# EAGLE design carrier_v2 (EAGLE 5.12)
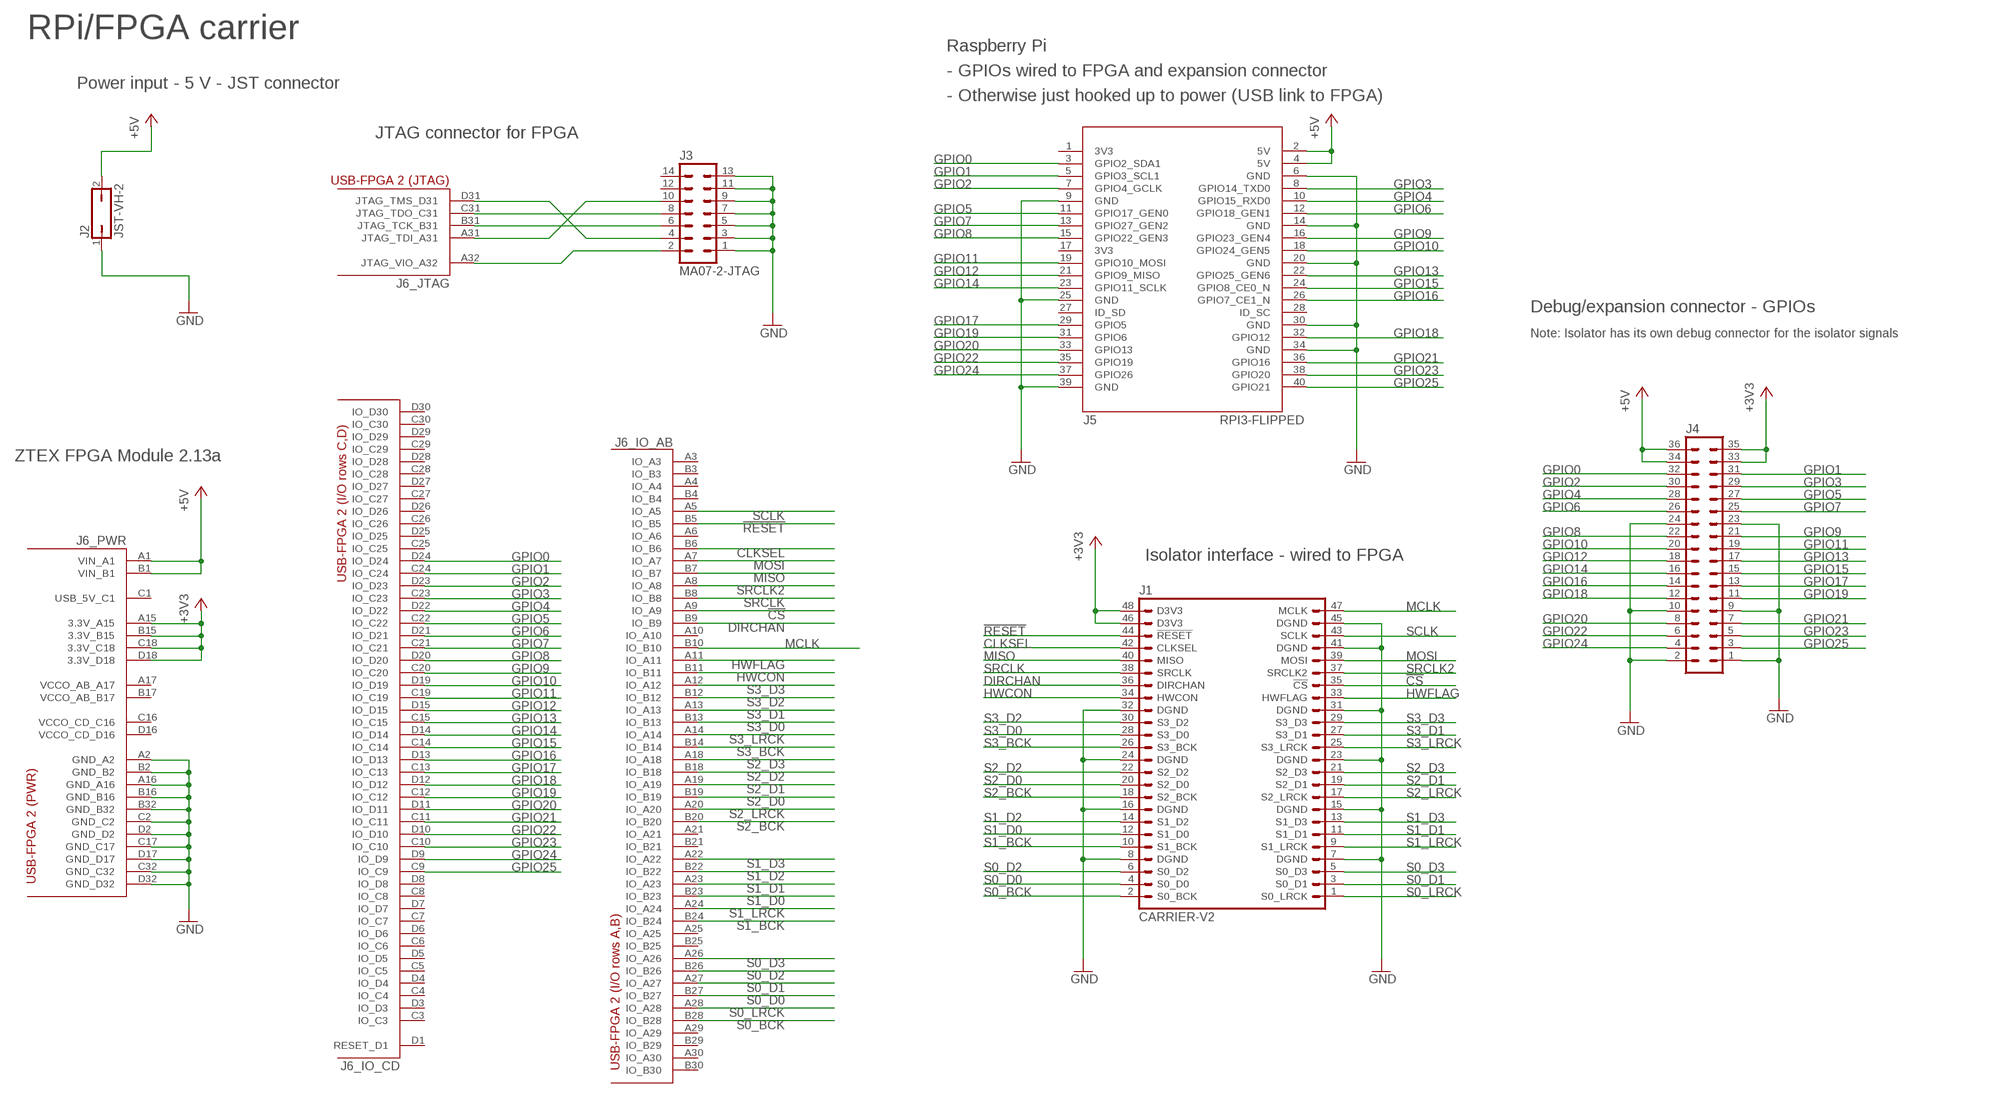
[diagram p0: schematic, sheet 1]

## Parts
J1  CARRIER-V2  [MA24-2]
J2  JST-VH-2  [JST-VH-2]
J3  MA07-2-JTAG  [MA07-2-JTAG]
J4  MA18-2  [MA18-2]
J5  RPI3-FLIPPED  [RPI3-FLIPPED]
J6  USB-FPGA-2THT  [USB-FPGA-2-THT]

## Nets
!CS: J1.35(!CS) J6.A9(_IO_AB:IO_A9)
!RESET: J1.44(!RESET) J6.B5(_IO_AB:IO_B5)
+3V3: J1.46(D3V3) J1.48(D3V3) J4.33 J4.35 J6.A15(_PWR:3.3V_A15) J6.B15(_PWR:3.3V_B15) J6.C18(_PWR:3.3V_C18) J6.D18(_PWR:3.3V_D18)
+5V: J2.2 J4.34 J4.36 J5.2(5V) J5.4(5V) J6.A1(_PWR:VIN_A1) J6.B1(_PWR:VIN_B1)
CLKSEL: J1.42(CLKSEL) J6.B6(_IO_AB:IO_B6)
DIRCHAN: J1.36(DIRCHAN) J6.B9(_IO_AB:IO_B9)
GND: J1.7(DGND) J1.8(DGND) J1.15(DGND) J1.16(DGND) J1.23(DGND) J1.24(DGND) J1.31(DGND) J1.32(DGND) J1.41(DGND) J1.45(DGND) J2.1 J3.1 J3.3 J3.5 J3.7 J3.9 J3.11 J3.13 J4.1 J4.2 J4.9 J4.10 J4.23 J4.24 J5.6(GND) J5.9(GND) J5.14(GND) J5.20(GND) J5.25(GND) J5.30(GND) J5.34(GND) J5.39(GND) J6.A2(_PWR:GND_A2) J6.A16(_PWR:GND_A16) J6.B2(_PWR:GND_B2) J6.B16(_PWR:GND_B16) J6.B32(_PWR:GND_B32) J6.C2(_PWR:GND_C2) J6.C17(_PWR:GND_C17) J6.C32(_PWR:GND_C32) J6.D2(_PWR:GND_D2) J6.D17(_PWR:GND_D17) J6.D32(_PWR:GND_D32)
GPIO0: J4.32 J5.3(GPIO2_SDA1) J6.D24(_IO_CD:IO_D24)
GPIO1: J4.31 J5.5(GPIO3_SCL1) J6.C24(_IO_CD:IO_C24)
GPIO2: J4.30 J5.7(GPIO4_GCLK) J6.D23(_IO_CD:IO_D23)
GPIO3: J4.29 J5.8(GPIO14_TXD0) J6.C23(_IO_CD:IO_C23)
GPIO4: J4.28 J5.10(GPIO15_RXD0) J6.D22(_IO_CD:IO_D22)
GPIO5: J4.27 J5.11(GPIO17_GEN0) J6.C22(_IO_CD:IO_C22)
GPIO6: J4.26 J5.12(GPIO18_GEN1) J6.D21(_IO_CD:IO_D21)
GPIO7: J4.25 J5.13(GPIO27_GEN2) J6.C21(_IO_CD:IO_C21)
GPIO8: J4.22 J5.15(GPIO22_GEN3) J6.D20(_IO_CD:IO_D20)
GPIO9: J4.21 J5.16(GPIO23_GEN4) J6.C20(_IO_CD:IO_C20)
GPIO10: J4.20 J5.18(GPIO24_GEN5) J6.D19(_IO_CD:IO_D19)
GPIO11: J4.19 J5.19(GPIO10_MOSI) J6.C19(_IO_CD:IO_C19)
GPIO12: J4.18 J5.21(GPIO9_MISO) J6.D15(_IO_CD:IO_D15)
GPIO13: J4.17 J5.22(GPIO25_GEN6) J6.C15(_IO_CD:IO_C15)
GPIO14: J4.16 J5.23(GPIO11_SCLK) J6.D14(_IO_CD:IO_D14)
GPIO15: J4.15 J5.24(GPIO8_CE0_N) J6.C14(_IO_CD:IO_C14)
GPIO16: J4.14 J5.26(GPIO7_CE1_N) J6.D13(_IO_CD:IO_D13)
GPIO17: J4.13 J5.29(GPIO5) J6.C13(_IO_CD:IO_C13)
GPIO18: J4.12 J5.32(GPIO12) J6.D12(_IO_CD:IO_D12)
GPIO19: J4.11 J5.31(GPIO6) J6.C12(_IO_CD:IO_C12)
GPIO20: J4.8 J5.33(GPIO13) J6.D11(_IO_CD:IO_D11)
GPIO21: J4.7 J5.36(GPIO16) J6.C11(_IO_CD:IO_C11)
GPIO22: J4.6 J5.35(GPIO19) J6.D10(_IO_CD:IO_D10)
GPIO23: J4.5 J5.38(GPIO20) J6.C10(_IO_CD:IO_C10)
GPIO24: J4.4 J5.37(GPIO26) J6.D9(_IO_CD:IO_D9)
GPIO25: J4.3 J5.40(GPIO21) J6.C9(_IO_CD:IO_C9)
HWCON: J1.34(HWCON) J6.B11(_IO_AB:IO_B11)
HWFLAG: J1.33(HWFLAG) J6.A11(_IO_AB:IO_A11)
MCLK: J1.47(MCLK) J6.B10(_IO_AB:IO_B10)
MISO: J1.40(MISO) J6.B7(_IO_AB:IO_B7)
MOSI: J1.39(MOSI) J6.A7(_IO_AB:IO_A7)
N$1: J3.2 J6.A32(_JTAG:JTAG_VIO_A32)
N$2: J3.4 J6.D31(_JTAG:JTAG_TMS_D31)
N$3: J3.6 J6.B31(_JTAG:JTAG_TCK_B31)
N$4: J3.8 J6.C31(_JTAG:JTAG_TDO_C31)
N$5: J3.10 J6.A31(_JTAG:JTAG_TDI_A31)
S0_BCK: J1.2(S0_BCK) J6.B28(_IO_AB:IO_B28)
S0_D0: J1.4(S0_D0) J6.B27(_IO_AB:IO_B27)
S0_D1: J1.3(S0_D1) J6.A27(_IO_AB:IO_A27)
S0_D2: J1.6(S0_D2) J6.B26(_IO_AB:IO_B26)
S0_D3: J1.5(S0_D3) J6.A26(_IO_AB:IO_A26)
S0_LRCK: J1.1(S0_LRCK) J6.A28(_IO_AB:IO_A28)
S1_BCK: J1.10(S1_BCK) J6.B24(_IO_AB:IO_B24)
S1_D0: J1.12(S1_D0) J6.B23(_IO_AB:IO_B23)
S1_D1: J1.11(S1_D1) J6.A23(_IO_AB:IO_A23)
S1_D2: J1.14(S1_D2) J6.B22(_IO_AB:IO_B22)
S1_D3: J1.13(S1_D3) J6.A22(_IO_AB:IO_A22)
S1_LRCK: J1.9(S1_LRCK) J6.A24(_IO_AB:IO_A24)
S2_BCK: J1.18(S2_BCK) J6.B20(_IO_AB:IO_B20)
S2_D0: J1.20(S2_D0) J6.B19(_IO_AB:IO_B19)
S2_D1: J1.19(S2_D1) J6.A19(_IO_AB:IO_A19)
S2_D2: J1.22(S2_D2) J6.B18(_IO_AB:IO_B18)
S2_D3: J1.21(S2_D3) J6.A18(_IO_AB:IO_A18)
S2_LRCK: J1.17(S2_LRCK) J6.A20(_IO_AB:IO_A20)
S3_BCK: J1.26(S3_BCK) J6.B14(_IO_AB:IO_B14)
S3_D0: J1.28(S3_D0) J6.B13(_IO_AB:IO_B13)
S3_D1: J1.27(S3_D1) J6.A13(_IO_AB:IO_A13)
S3_D2: J1.30(S3_D2) J6.B12(_IO_AB:IO_B12)
S3_D3: J1.29(S3_D3) J6.A12(_IO_AB:IO_A12)
S3_LRCK: J1.25(S3_LRCK) J6.A14(_IO_AB:IO_A14)
SCLK: J1.43(SCLK) J6.A5(_IO_AB:IO_A5)
SRCLK: J1.38(SRCLK) J6.B8(_IO_AB:IO_B8)
SRCLK2: J1.37(SRCLK2) J6.A8(_IO_AB:IO_A8)
Unconnected: J3.12 J3.14 J5.1(3V3) J5.17(3V3) J5.27(ID_SD) J5.28(ID_SC) J6.A3(_IO_AB:IO_A3) J6.A4(_IO_AB:IO_A4) J6.A6(_IO_AB:IO_A6) J6.A10(_IO_AB:IO_A10) J6.A17(_PWR:VCCO_AB_A17) J6.A21(_IO_AB:IO_A21) J6.A25(_IO_AB:IO_A25) J6.A29(_IO_AB:IO_A29) J6.A30(_IO_AB:IO_A30) J6.B3(_IO_AB:IO_B3) J6.B4(_IO_AB:IO_B4) J6.B17(_PWR:VCCO_AB_B17) J6.B21(_IO_AB:IO_B21) J6.B25(_IO_AB:IO_B25) J6.B29(_IO_AB:IO_B29) J6.B30(_IO_AB:IO_B30) J6.C1(_PWR:USB_5V_C1) J6.C3(_IO_CD:IO_C3) J6.C4(_IO_CD:IO_C4) J6.C5(_IO_CD:IO_C5) J6.C6(_IO_CD:IO_C6) J6.C7(_IO_CD:IO_C7) J6.C8(_IO_CD:IO_C8) J6.C16(_PWR:VCCO_CD_C16) J6.C25(_IO_CD:IO_C25) J6.C26(_IO_CD:IO_C26) J6.C27(_IO_CD:IO_C27) J6.C28(_IO_CD:IO_C28) J6.C29(_IO_CD:IO_C29) J6.C30(_IO_CD:IO_C30) J6.D1(_IO_CD:RESET_D1) J6.D3(_IO_CD:IO_D3) J6.D4(_IO_CD:IO_D4) J6.D5(_IO_CD:IO_D5) J6.D6(_IO_CD:IO_D6) J6.D7(_IO_CD:IO_D7) J6.D8(_IO_CD:IO_D8) J6.D16(_PWR:VCCO_CD_D16) J6.D25(_IO_CD:IO_D25) J6.D26(_IO_CD:IO_D26) J6.D27(_IO_CD:IO_D27) J6.D28(_IO_CD:IO_D28) J6.D29(_IO_CD:IO_D29) J6.D30(_IO_CD:IO_D30)

## Notes on the sheet
- RPi/FPGA carrier
- Raspberry Pi
- - GPIOs wired to FPGA and expansion connector
- Power input - 5 V - JST connector
- - Otherwise just hooked up to power (USB link to FPGA)
- JTAG connector for FPGA
- Debug/expansion connector - GPIOs
- Note: Isolator has its own debug connector for the isolator signals
- ZTEX FPGA Module 2.13a
- Isolator interface - wired to FPGA

## Library data of the parts
J1 = cdp:CARRIER-V2
J2 = cdp:JST-VH-2
J3 = cdp:MA07-2-JTAG
J4 = con-lstb:MA18-2: PIN HEADER; OC_FARNELL: unknown; OC_NEWARK: unknown
J5 = cdp:RPI3-FLIPPED
J6 = ztex-usb-fpga-2:USB-FPGA-2

## Board
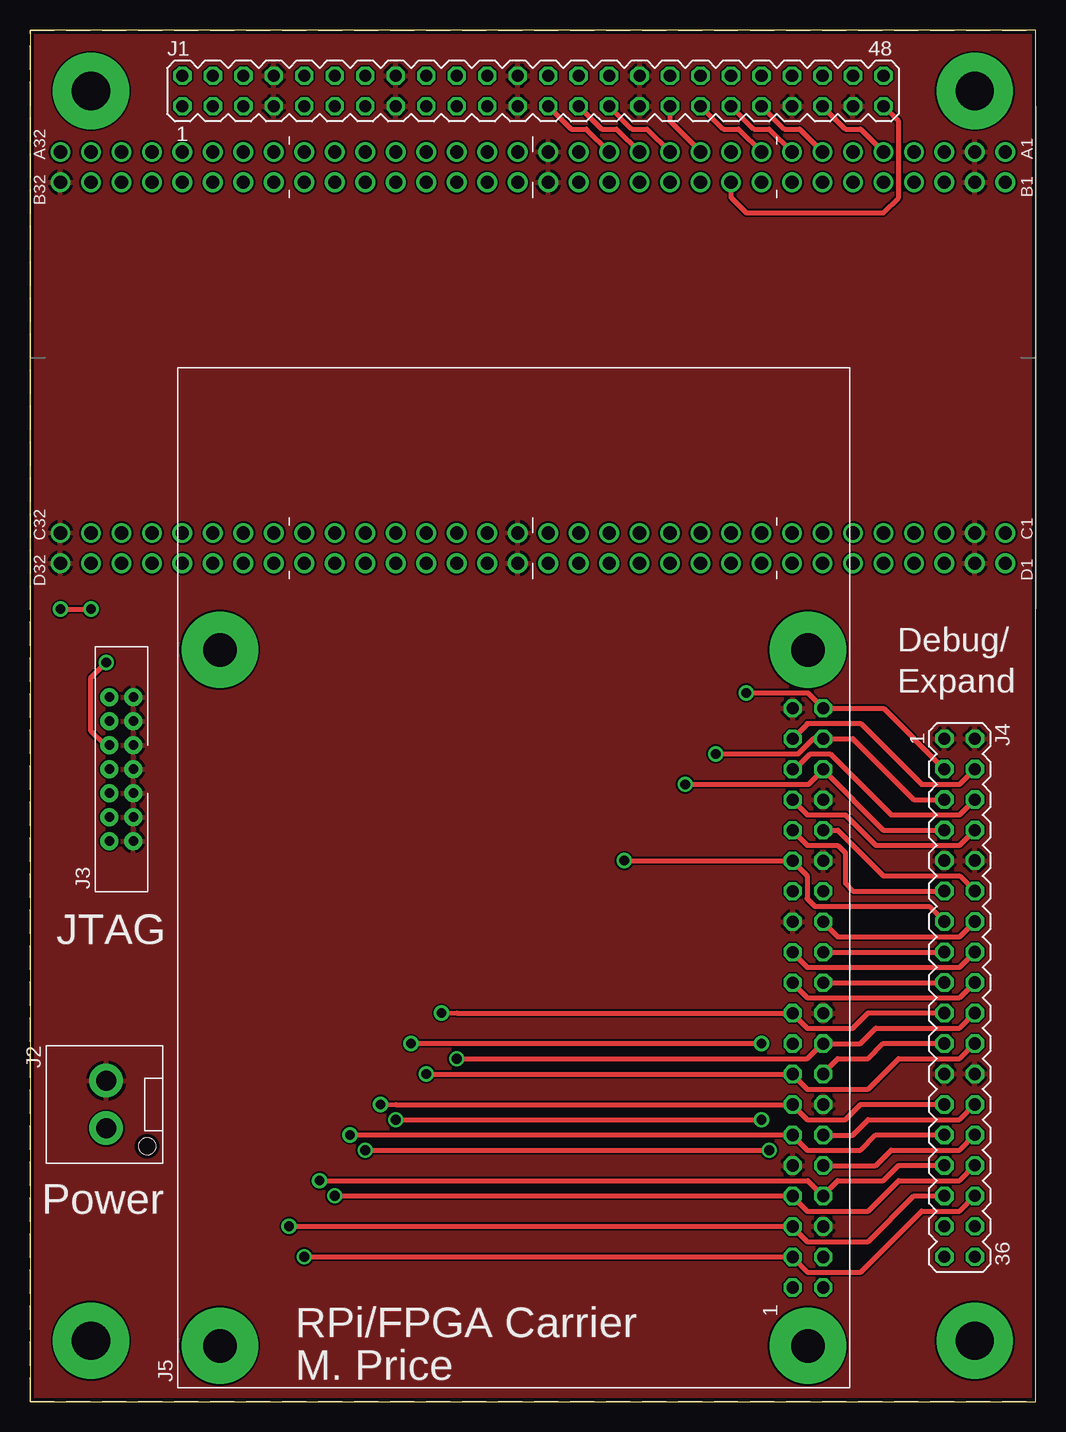
[diagram p1: board, top side]
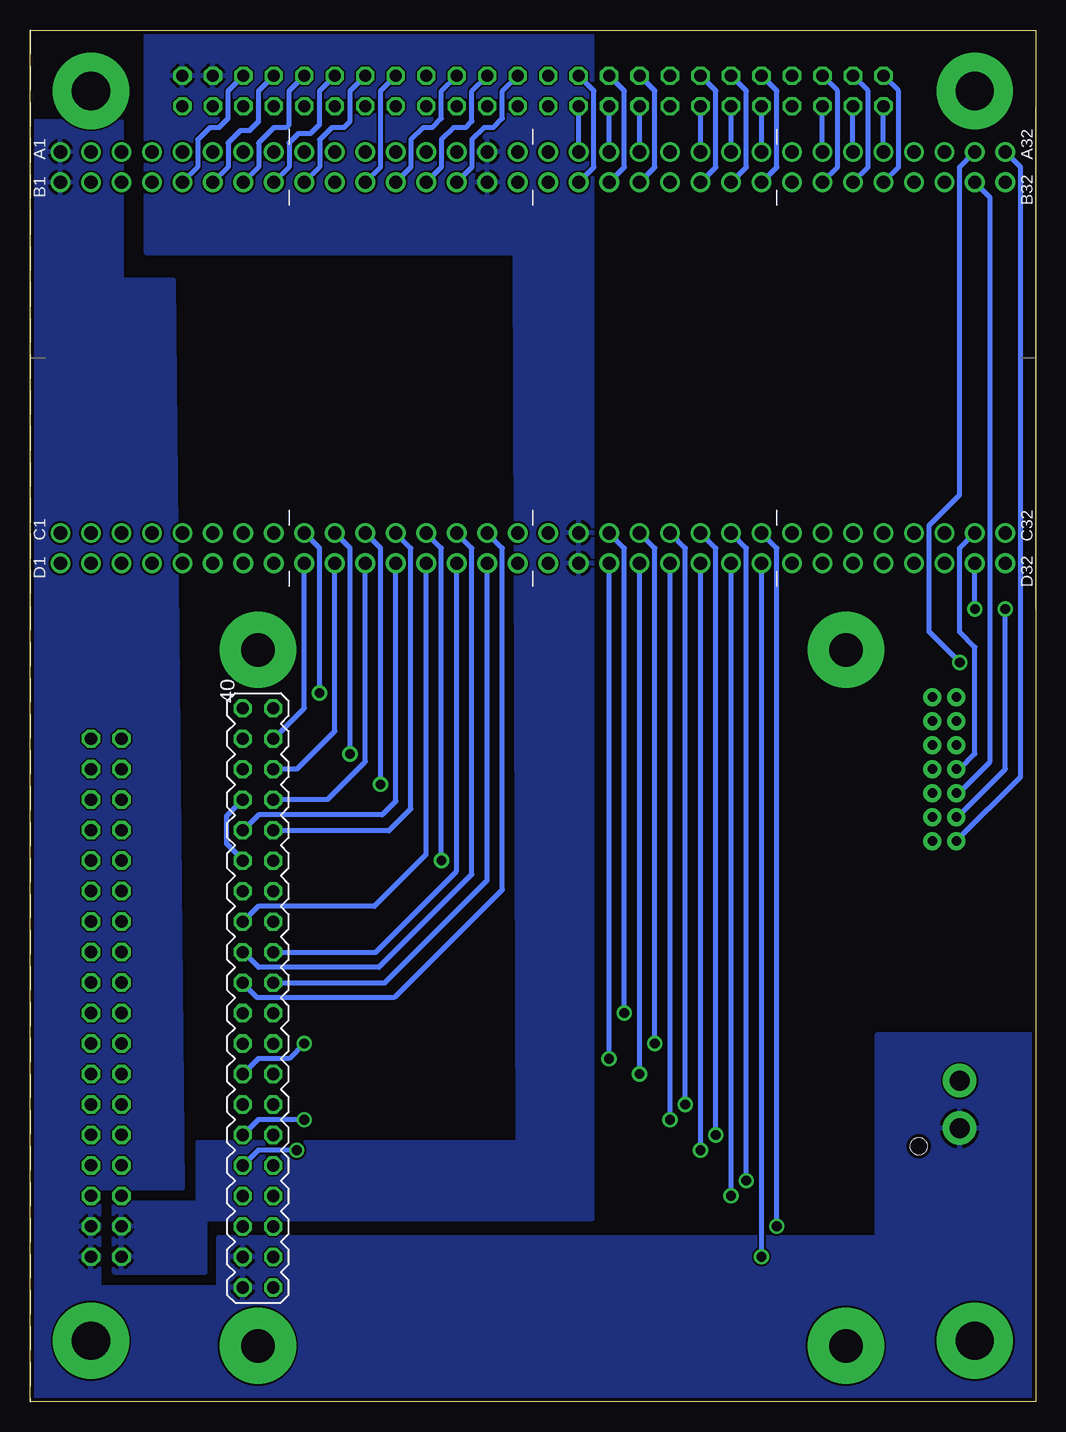
[diagram p2: board, bottom side, seen from below]

Size 83.82 x 114.3 mm. Coordinates in mm from the lower left corner, seen from the top.
Outline: 0,0 83.82,0 83.82,114.3 0,114.3 0,0
Copper layers (1*16): Top 0.035mm / dielectric 1.6mm / Bottom 0.035mm
Design rules "Elecrow_2-layer_PCB_eagle_rule_mod": minimum track width 6mil, minimum drill 12mil, track to track 6mil, track to pad 6mil, pad to pad 6mil, via to via 8mil, smd to smd 0mil, copper to edge 12mil, drill to drill 10mil, minimum pad ring 6mil, minimum via ring 6mil, stop-mask expansion 0mil, vias tented up to drill 100mil, thermal gap 10mil

### Footprints (pad centres in the part's own frame; a part is rotated, then mirrored left to right if it is on the bottom)
MA24-2 = drill 1.016 octagon: 1 -29.21,-1.27; 2 -29.21,1.27; 3 -26.67,-1.27; 4 -26.67,1.27; 5 -24.13,-1.27; 6 -24.13,1.27; 7 -21.59,-1.27; 8 -21.59,1.27; 9 -19.05,-1.27; 10 -19.05,1.27; 11 -16.51,-1.27; 12 -16.51,1.27; 13 -13.97,-1.27; 14 -13.97,1.27; 15 -11.43,-1.27; 16 -11.43,1.27; 17 -8.89,-1.27; 18 -8.89,1.27; 19 -6.35,-1.27; 20 -6.35,1.27; 21 -3.81,-1.27; 22 -3.81,1.27; 23 -1.27,-1.27; 24 -1.27,1.27; 25 1.27,-1.27; 26 1.27,1.27; 27 3.81,-1.27; 28 3.81,1.27; 29 6.35,-1.27; 30 6.35,1.27; 31 8.89,-1.27; 32 8.89,1.27; 33 11.43,-1.27; 34 11.43,1.27; 35 13.97,-1.27; 36 13.97,1.27; 37 16.51,-1.27; 38 16.51,1.27; 39 19.05,-1.27; 40 19.05,1.27; 41 21.59,-1.27; 42 21.59,1.27; 43 24.13,-1.27; 44 24.13,1.27; 45 26.67,-1.27; 46 26.67,1.27; 47 29.21,-1.27; 48 29.21,1.27 | drill 3.175 pad 6.35 round: DP1 -36.83,0; DP2 36.83,0; DP3 -36.83,-104.14; DP4 36.83,-104.14
JST-VH-2 = drill 1.65 pad 2.8 round: 1 -1.98,0; 2 1.98,0 | hole 1.4: 3.48,3.4
MA07-2-JTAG = drill 0.8 pad 1.5 round: 1 -6,-1; 2 -6,1; 3 -4,-1; 4 -4,1; 5 -2,-1; 6 -2,1; 7 0,-1; 8 0,1; 9 2,-1; 10 2,1; 11 4,-1; 12 4,1; 13 6,-1; 14 6,1
MA18-2 = drill 1.016 octagon: 1 -21.59,-1.27; 2 -21.59,1.27; 3 -19.05,-1.27; 4 -19.05,1.27; 5 -16.51,-1.27; 6 -16.51,1.27; 7 -13.97,-1.27; 8 -13.97,1.27; 9 -11.43,-1.27; 10 -11.43,1.27; 11 -8.89,-1.27; 12 -8.89,1.27; 13 -6.35,-1.27; 14 -6.35,1.27; 15 -3.81,-1.27; 16 -3.81,1.27; 17 -1.27,-1.27; 18 -1.27,1.27; 19 1.27,-1.27; 20 1.27,1.27; 21 3.81,-1.27; 22 3.81,1.27; 23 6.35,-1.27; 24 6.35,1.27; 25 8.89,-1.27; 26 8.89,1.27; 27 11.43,-1.27; 28 11.43,1.27; 29 13.97,-1.27; 30 13.97,1.27; 31 16.51,-1.27; 32 16.51,1.27; 33 19.05,-1.27; 34 19.05,1.27; 35 21.59,-1.27; 36 21.59,1.27
RPI3-FLIPPED = drill 1.016 octagon: 1 8.37,4.77; 2 8.37,2.23; 3 10.91,4.77; 4 10.91,2.23; 5 13.45,4.77; 6 13.45,2.23; 7 15.99,4.77; 8 15.99,2.23; 9 18.53,4.77; 10 18.53,2.23; 11 21.07,4.77; 12 21.07,2.23; 13 23.61,4.77; 14 23.61,2.23; 15 26.15,4.77; 16 26.15,2.23; 17 28.69,4.77; 18 28.69,2.23; 19 31.23,4.77; 20 31.23,2.23; 21 33.77,4.77; 22 33.77,2.23; 23 36.31,4.77; 24 36.31,2.23; 25 38.85,4.77; 26 38.85,2.23; 27 41.39,4.77; 28 41.39,2.23; 29 43.93,4.77; 30 43.93,2.23; 31 46.47,4.77; 32 46.47,2.23; 33 49.01,4.77; 34 49.01,2.23; 35 51.55,4.77; 36 51.55,2.23; 37 54.09,4.77; 38 54.09,2.23; 39 56.63,4.77; 40 56.63,2.23 | drill 2.794 pad 6.35 round: P$1 3.5,3.5; P$2 61.5,3.5; P$3 3.5,52.5; P$4 61.5,52.5
USB-FPGA-2-THT = drill 1.1 round: A1 2.54,2.54; A2 5.08,2.54; A3 7.62,2.54; A4 10.16,2.54; A5 12.7,2.54; A6 15.24,2.54; A7 17.78,2.54; A8 20.32,2.54; A9 22.86,2.54; A10 25.4,2.54; A11 27.94,2.54; A12 30.48,2.54; A13 33.02,2.54; A14 35.56,2.54; A15 38.1,2.54; A16 40.64,2.54; A17 43.18,2.54; A18 45.72,2.54; A19 48.26,2.54; A20 50.8,2.54; A21 53.34,2.54; A22 55.88,2.54; A23 58.42,2.54; A24 60.96,2.54; A25 63.5,2.54; A26 66.04,2.54; A27 68.58,2.54; A28 71.12,2.54; A29 73.66,2.54; A30 76.2,2.54; A31 78.74,2.54; A32 81.28,2.54; B1 2.54,5.08; B2 5.08,5.08; B3 7.62,5.08; B4 10.16,5.08; B5 12.7,5.08; B6 15.24,5.08; B7 17.78,5.08; B8 20.32,5.08; B9 22.86,5.08; B10 25.4,5.08; B11 27.94,5.08; B12 30.48,5.08; B13 33.02,5.08; B14 35.56,5.08; B15 38.1,5.08; B16 40.64,5.08; B17 43.18,5.08; B18 45.72,5.08; B19 48.26,5.08; B20 50.8,5.08; B21 53.34,5.08; B22 55.88,5.08; B23 58.42,5.08; B24 60.96,5.08; B25 63.5,5.08; B26 66.04,5.08; B27 68.58,5.08; B28 71.12,5.08; B29 73.66,5.08; B30 76.2,5.08; B31 78.74,5.08; B32 81.28,5.08; C1 2.54,34.29; C2 5.08,34.29; C3 7.62,34.29; C4 10.16,34.29; C5 12.7,34.29; C6 15.24,34.29; C7 17.78,34.29; C8 20.32,34.29; C9 22.86,34.29; C10 25.4,34.29; C11 27.94,34.29; C12 30.48,34.29; C13 33.02,34.29; C14 35.56,34.29; C15 38.1,34.29; C16 40.64,34.29; C17 43.18,34.29; C18 45.72,34.29; C19 48.26,34.29; C20 50.8,34.29; C21 53.34,34.29; C22 55.88,34.29; C23 58.42,34.29; C24 60.96,34.29; C25 63.5,34.29; C26 66.04,34.29; C27 68.58,34.29; C28 71.12,34.29; C29 73.66,34.29; C30 76.2,34.29; C31 78.74,34.29; C32 81.28,34.29; D1 2.54,36.83; D2 5.08,36.83; D3 7.62,36.83; D4 10.16,36.83; D5 12.7,36.83; D6 15.24,36.83; D7 17.78,36.83; D8 20.32,36.83; D9 22.86,36.83; D10 25.4,36.83; D11 27.94,36.83; D12 30.48,36.83; D13 33.02,36.83; D14 35.56,36.83; D15 38.1,36.83; D16 40.64,36.83; D17 43.18,36.83; D18 45.72,36.83; D19 48.26,36.83; D20 50.8,36.83; D21 53.34,36.83; D22 55.88,36.83; D23 58.42,36.83; D24 60.96,36.83; D25 63.5,36.83; D26 66.04,36.83; D27 68.58,36.83; D28 71.12,36.83; D29 73.66,36.83; D30 76.2,36.83; D31 78.74,36.83; D32 81.28,36.83

### Placement (x,y rotation side)
J1  41.91,109.22 0 top
J2  6.35,24.77 270 top
J3  7.62,52.7 90 top
J4  77.47,33.66 270 top
J5  68.33,1.14 90 top
J6  83.82,106.68 180 top

### Tracks (layer width: path | path; a pad name or v marks a point on that pad's centre or on a via)
!CS
  Top 0.406: J6.A9 59.05,106.05 57.78,106.05 J1.35
!RESET
  Bottom 0.406: J6.B5 69.85,102.87 69.85,105.16 68.83,106.17 68.07,106.17 67.31,106.93 67.31,109.22 J1.44
+3V3
  pour Bottom: 74.17,114.3 74.17,95.76 43.43,95.76 43.18,21.59 69.85,21.59 69.85,16.51 76.83,16.51 76.83,10.79 69.22,10.79 69.22,15.24 43.43,15.24 36.96,15.24 36.96,114.3
+5V
  pour Bottom: 83.57,93.47 83.82,106.68 76.2,106.68 76.2,93.47 71.88,93.47 71.12,17.78 78.11,17.78 78.11,9.53 68.07,9.53 68.07,13.72 13.21,13.72 13.21,30.61 0.25,30.61 0.25,0 83.57,0
CLKSEL
  Bottom 0.406: J6.B6 67.31,102.87 67.31,104.9 66.29,105.92 65.53,105.92 64.77,106.68 64.77,109.22 J1.42
DIRCHAN
  Bottom 0.406: J6.B9 59.69,102.87 59.69,105.16 58.67,106.17 57.66,106.17 57.15,106.68 57.15,109.22 J1.36
GND
  Bottom 0.406: J5.30 66.1,45.14 67.44,46.48 67.44,48.81 J5.34
  pour Top: 0,114.3 84.07,114.3 84.07,0 0,0
GPIO0  (via drill 0.81 pad 1.27)
  Top 0.406: J4.32 77.47,15.88 74.3,15.88 69.22,10.79 64.77,10.79 63.56,12.01 J5.3 63.54,12.06 v22.86,12.06
  Bottom 0.406: v22.86,12.06 J6.D24
GPIO1  (via drill 0.81 pad 1.27)
  Top 0.406: J4.31 73.66,17.14 69.85,13.34 64.77,13.34 63.56,14.55 J5.5 63.54,14.61 v21.59,14.61
  Bottom 0.406: J6.C24 21.59,71.12 v21.59,14.61
GPIO2  (via drill 0.81 pad 1.27)
  Top 0.406: J4.30 77.47,18.41 72.39,18.41 69.85,15.88 64.77,15.88 63.56,17.09 J5.7 63.54,17.14 v25.4,17.14
  Bottom 0.406: v25.4,17.14 J6.D23
GPIO3  (via drill 0.81 pad 1.27)
  Top 0.406: J4.29 72.39,19.68 71.12,18.41 67.31,18.41 66.1,17.2 J5.8 64.81,18.41 v24.13,18.41
  Bottom 0.406: J6.C23 24.13,71.12 v24.13,18.41
GPIO4  (via drill 0.81 pad 1.27)
  Top 0.406: J4.28 77.47,20.95 71.75,20.95 70.47,19.67 J5.10 | v27.94,20.95 v61.59,20.95
  Bottom 0.406: v27.94,20.95 J6.D22 | v61.59,20.95 64.81,20.95 J5.10
GPIO5  (via drill 0.81 pad 1.27)
  Top 0.406: J4.27 70.48,22.23 69.22,20.95 64.77,20.95 63.56,22.17 J5.11 63.54,22.23 v26.67,22.23
  Bottom 0.406: J6.C22 26.67,71.12 v26.67,22.23
GPIO6  (via drill 0.81 pad 1.27)
  Top 0.406: J4.26 77.47,23.5 69.85,23.5 68.57,22.21 J5.12 | v30.48,23.5 v60.96,23.5
  Bottom 0.406: v30.48,23.5 J6.D21 | v60.96,23.5 64.81,23.5 J5.12
GPIO7  (via drill 0.81 pad 1.27)
  Top 0.406: J4.25 69.22,24.77 67.94,23.5 64.77,23.5 63.56,24.71 J5.13 30.49,24.75 v29.21,24.77
  Bottom 0.406: v29.21,24.77 29.21,71.12 J6.C21
GPIO8  (via drill 0.81 pad 1.27)
  Top 0.406: J4.22 77.47,28.57 72.39,28.57 69.85,26.04 64.77,26.04 63.56,27.25 J5.15 33.03,27.29 v33.02,27.3
  Bottom 0.406: v33.02,27.3 J6.D20
GPIO9  (via drill 0.81 pad 1.27)
  Top 0.406: J4.21 71.12,29.84 69.85,28.57 67.31,28.57 66.1,27.36 J5.16 | v31.75,29.84 v60.96,29.84
  Bottom 0.406: J6.C20 31.75,71.12 v31.75,29.84 | v60.96,29.84 62.23,28.57 64.81,28.57 J5.16
GPIO10  (via drill 0.81 pad 1.27)
  Top 0.406: J4.20 77.47,31.11 70.48,31.11 69.2,29.83 J5.18 66.03,29.83 64.77,28.57 v35.56,28.57
  Bottom 0.406: v35.56,28.57 J6.D19
GPIO11  (via drill 0.81 pad 1.27)
  Top 0.406: J4.19 69.85,32.38 68.58,31.11 64.77,31.11 63.56,32.33 J5.19 35.57,32.37 v34.29,32.38
  Bottom 0.406: v34.29,32.38 34.29,71.12 J6.C19
GPIO12
  Top 0.406: J4.18 77.47,33.66 64.77,33.66 63.56,34.87 J5.21
  Bottom 0.406: J6.D15 45.72,43.43 54.28,34.87 63.51,34.87 J5.21
GPIO13
  Top 0.406: J4.17 76.19,34.91 J5.22
  Bottom 0.406: J6.C15 44.45,71.12 44.45,42.67 53.47,33.66 64.9,33.66 66.1,34.85 J5.22
GPIO14
  Top 0.406: J4.16 77.47,36.2 64.77,36.2 63.56,37.41 J5.23
  Bottom 0.406: J6.D14 48.26,44.2 55.05,37.41 63.51,37.41 J5.23
GPIO15
  Top 0.406: J4.15 76.19,37.45 J5.24
  Bottom 0.406: J6.C14 46.99,71.12 46.99,43.94 54.74,36.2 64.77,36.2 66.03,37.45 J5.24
GPIO16
  Top 0.406: J4.14 77.47,38.73 67.31,38.73 66.1,39.95 J5.26
  Bottom 0.406: J6.D13 50.8,45.59 55.12,41.27 64.81,41.27 J5.26
GPIO17  (via drill 0.81 pad 1.27)
  Top 0.406: J4.13 74.93,41.27 65.41,41.27 64.77,41.91 64.77,43.81 63.56,45.03 J5.29 49.54,45.07 v49.53,45.09
  Bottom 0.406: J6.C13 49.53,71.12 49.53,45.59 v49.53,45.09
GPIO18
  Top 0.406: J4.12 77.47,43.81 71.12,43.81 67.32,47.61 J5.32
  Bottom 0.406: J6.D12 53.34,50.04 54.48,48.9 64.77,48.9 66.05,47.61 J5.32
GPIO19
  Top 0.406: J4.11 68.58,42.55 67.94,43.18 67.94,45.72 67.31,46.35 64.77,46.35 63.56,47.57 J5.31
  Bottom 0.406: J6.C12 52.07,71.12 52.07,49.4 53.9,47.57 63.51,47.57 J5.31
GPIO20
  Top 0.406: J4.8 77.47,46.35 70.48,46.35 67.94,48.9 64.77,48.9 63.56,50.11 J5.33
  Bottom 0.406: J6.D11 55.88,53.34 59.05,50.16 63.54,50.16 J5.33
GPIO21  (via drill 0.81 pad 1.27)
  Top 0.406: J4.7 71.12,47.62 66.1,52.65 | 66.1,52.65 J5.36 | 66.1,52.65 64.88,51.44 v54.61,51.44
  Bottom 0.406: J6.C11 54.61,71.12 v54.61,51.44
GPIO22
  Top 0.406: J4.6 77.47,48.9 71.75,48.9 66.67,53.98 65.02,53.98 63.81,52.76 J5.35
  Bottom 0.406: J6.D10 58.42,55.88 61.59,52.7 63.54,52.7 J5.35
GPIO23  (via drill 0.81 pad 1.27)
  Top 0.406: 66.11,55.24 J5.38 | 66.11,55.24 68.58,55.24 73.66,50.16 J4.5 | 66.11,55.24 65.28,55.24 64.01,53.98 v57.15,53.98
  Bottom 0.406: J6.C10 57.15,71.12 v57.15,53.98
GPIO24
  Top 0.406: 63.56,55.3 J5.37 64.77,56.45 64.77,56.52 69.22,56.52 74.3,51.44 77.47,51.44 J4.4
  Bottom 0.406: J6.D9 60.96,57.78 63.5,55.24 63.54,55.24 J5.37
GPIO25  (via drill 0.81 pad 1.27)
  Top 0.406: J4.3 71.13,57.77 J5.40 64.81,59.05 v59.69,59.05
  Bottom 0.406: J6.C9 59.69,71.12 v59.69,59.05
HWCON
  Bottom 0.406: J6.B11 54.61,102.87 54.61,109.22 J1.34
HWFLAG
  Top 0.406: J6.A11 53.34,106.68 J1.33
MCLK
  Top 0.406: J1.47 72.39,106.68 72.39,100.33 71.12,99.06 59.69,99.06 58.42,100.33 J6.B10
MISO
  Bottom 0.406: J6.B7 64.77,102.87 64.77,104.9 63.5,106.17 62.48,106.17 62.23,106.43 62.23,109.22 J1.40
MOSI
  Top 0.406: J6.A7 64.14,106.05 62.87,106.05 J1.39
N$1
  Bottom 0.406: J6.A32 1.27,102.87 1.27,52.07 6.62,46.72 J3.2
N$2  (via drill 0.81 pad 1.27)
  Top 0.406: v2.54,66.04 v5.08,66.04
  Bottom 0.406: v5.08,66.04 J6.D31 | v2.54,66.04 2.54,52.7 6.54,48.7 J3.4
N$3
  Bottom 0.406: J6.B31 3.81,100.33 3.81,53.34 6.45,50.7 J3.6
N$4
  Bottom 0.406: J6.C31 6.35,71.12 6.35,64.14 5.08,62.87 5.08,53.98 6.35,52.7 J3.8
N$5  (via drill 0.81 pad 1.27)
  Top 0.406: v6.35,61.59 5.08,60.33 5.08,55.88 6.25,54.7 J3.10
  Bottom 0.406: J6.A31 6.35,102.87 6.35,75.56 8.89,73.03 8.89,64.14 v6.35,61.59
S0_BCK
  Bottom 0.406: J6.B28 11.43,102.87 11.43,109.22 J1.2
S0_D0
  Bottom 0.406: J6.B27 13.97,102.87 13.97,109.22 J1.4
S0_D1
  Bottom 0.406: J6.A27 J1.3
S0_D2
  Bottom 0.406: J6.B26 16.51,102.87 16.51,109.22 J1.6
S0_D3
  Bottom 0.406: J6.A26 J1.5
S0_LRCK
  Bottom 0.406: J6.A28 J1.1
S1_BCK
  Bottom 0.406: J6.B24 21.59,102.87 21.59,109.22 J1.10
S1_D0
  Bottom 0.406: J6.B23 24.13,102.87 24.13,109.22 J1.12
S1_D1
  Bottom 0.406: J6.A23 J1.11
S1_D2
  Bottom 0.406: J6.B22 26.67,102.87 26.67,109.22 J1.14
S1_D3
  Bottom 0.406: J6.A22 J1.13
S1_LRCK
  Bottom 0.406: J6.A24 J1.9
S2_BCK
  Bottom 0.406: J6.B20 31.75,102.87 31.75,109.22 J1.18
S2_D0
  Bottom 0.406: J6.B19 34.29,102.87 34.29,109.22 J1.20
S2_D1
  Bottom 0.406: J6.A19 J1.19
S2_D2
  Bottom 0.406: J6.B18 36.83,102.87 36.83,109.22 J1.22
S2_D3
  Bottom 0.406: J6.A18 J1.21
S2_LRCK
  Bottom 0.406: J6.A20 J1.17
S3_BCK
  Bottom 0.406: J6.B14 46.99,102.87 46.99,105.16 45.97,106.17 45.21,106.17 44.45,106.93 44.45,109.22 J1.26
S3_D0
  Bottom 0.406: J6.B13 49.53,102.87 49.53,105.16 48.51,106.17 47.5,106.17 46.99,106.68 46.99,109.22 J1.28
S3_D1
  Top 0.406: J6.A13 48.9,106.05 47.62,106.05 J1.27
S3_D2
  Bottom 0.406: J6.B12 52.07,102.87 52.07,105.16 51.05,106.17 50.29,106.17 49.53,106.93 49.53,109.22 J1.30
S3_D3
  Top 0.406: J6.A12 51.44,106.05 50.16,106.05 J1.29
S3_LRCK
  Top 0.406: J6.A14 46.35,106.05 45.09,106.05 J1.25
SCLK
  Top 0.406: J6.A5 69.22,106.05 67.94,106.05 J1.43
SRCLK
  Bottom 0.406: J6.B8 62.23,102.87 62.23,104.9 61.47,105.66 60.45,105.66 59.69,106.43 59.69,109.22 J1.38
SRCLK2
  Top 0.406: J6.A8 61.59,106.05 60.33,106.05 J1.37

### Text on the board
tPlace: Debug/ | Expand | JTAG | Power | RPi/FPGA Carrier | M. Price